# EAGLE design pwmdmx_rev_B (EAGLE 5.10)
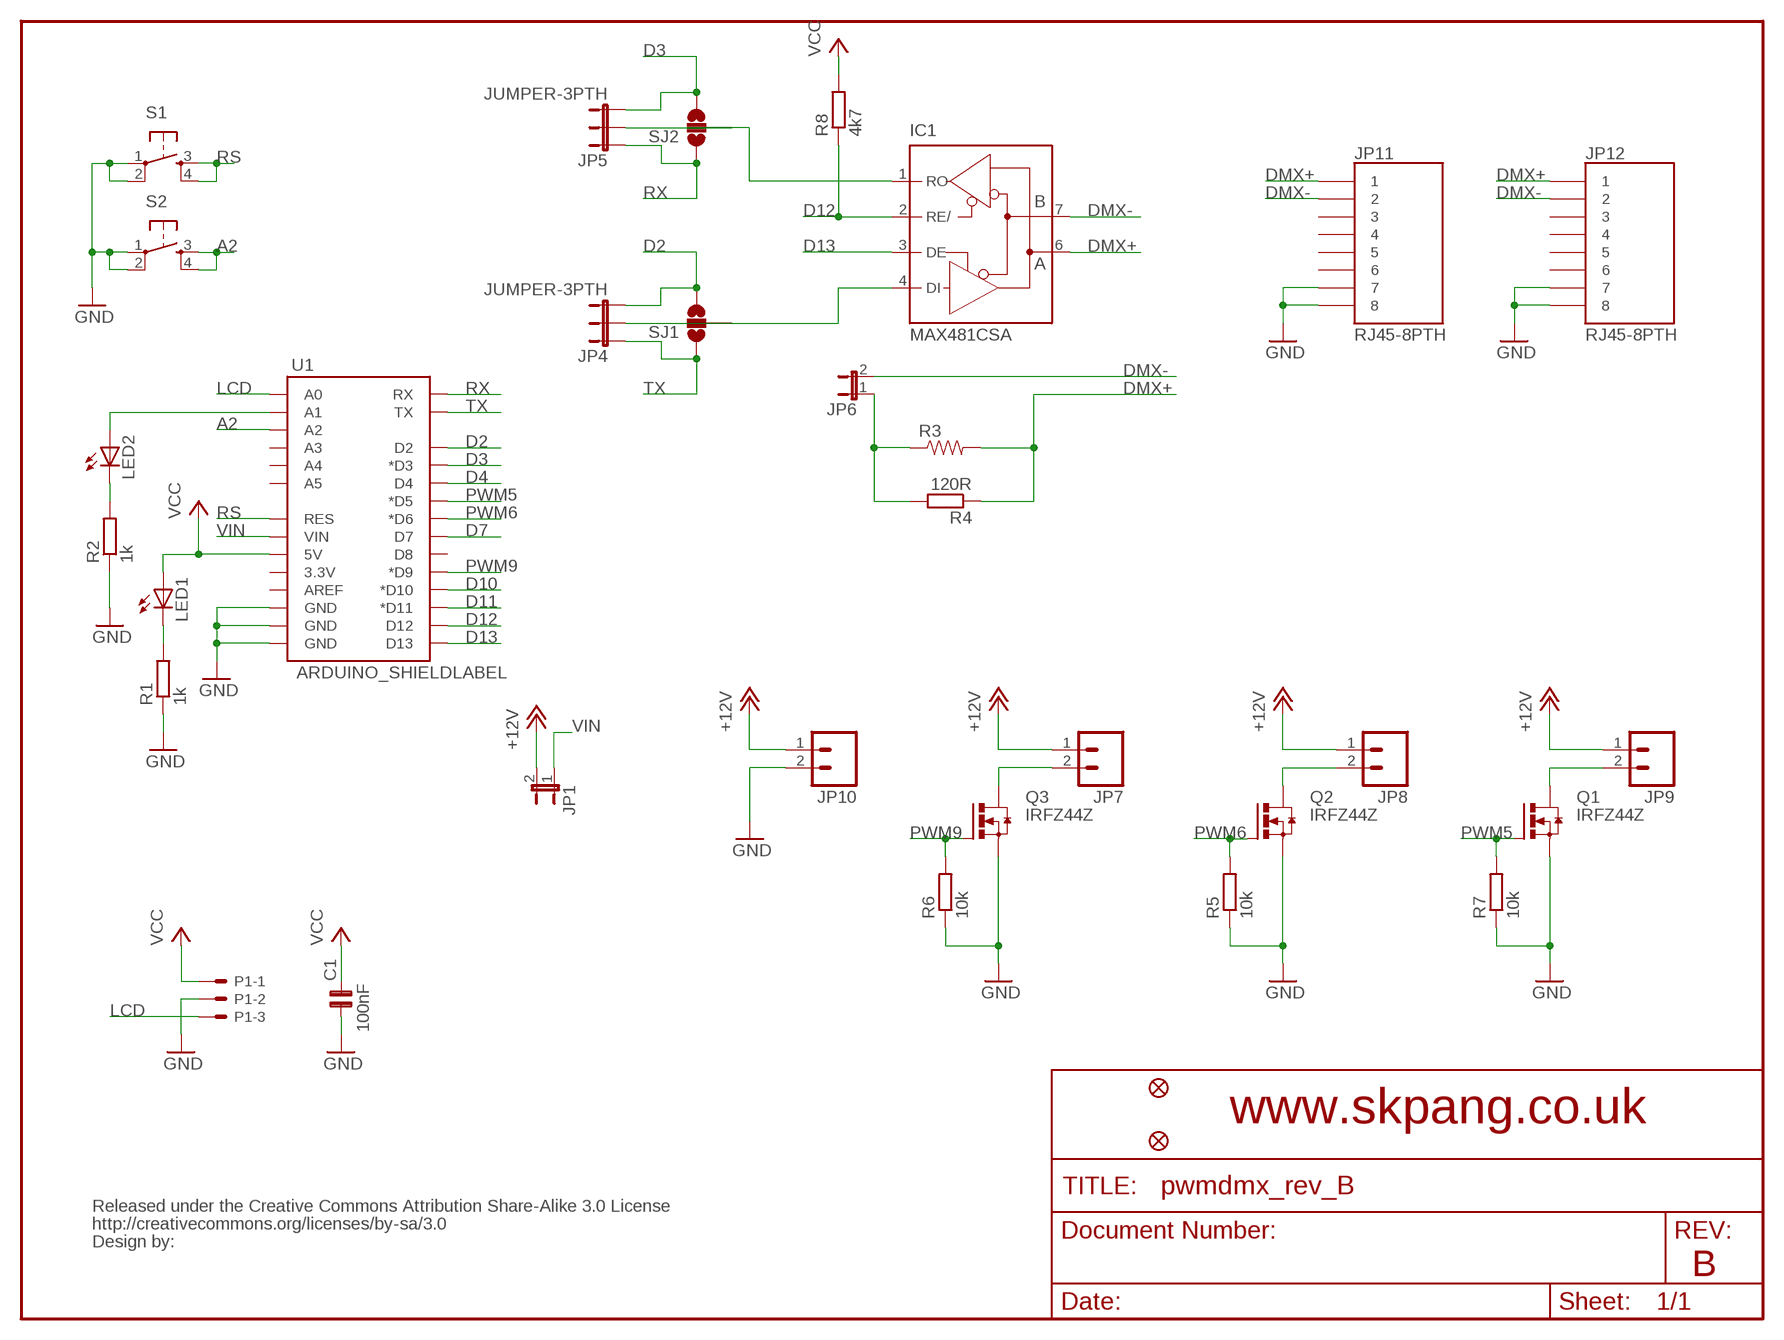
[diagram p0: schematic, sheet 1]

## Parts
C1  100nF  C-NP-SMD-0603  [C-0603]
IC1  MAX481CSA  [SO08]
JP1  JUMPER-2SMD-NO  [SJ_2S-NO]
JP2  FIDUCIAL1X2  [FIDUCIAL-1X2]
JP3  FIDUCIAL1X2  [FIDUCIAL-1X2]
JP4  JUMPER-3PTH  [1X03]
JP5  JUMPER-3PTH  [1X03]
JP6  JUMPER-2PTH  [1X02]
JP7  M025MM  [SCREWTERMINAL-5MM-2]
JP8  M025MM  [SCREWTERMINAL-5MM-2]
JP9  M025MM  [SCREWTERMINAL-5MM-2]
JP10  M025MM  [SCREWTERMINAL-5MM-2]
JP11  RJ45-8PTH  [RJ45-8]
JP12  RJ45-8PTH  [RJ45-8]
LED1  LEDCHIPLED_0805  [CHIPLED_0805]
LED2  LEDCHIPLED_0805  [CHIPLED_0805]
P1  22-23-2031  [22-23-2031]
Q1  IRFZ44Z  IRF3704S  [D2PACK]
Q2  IRFZ44Z  IRF3704S  [D2PACK]
Q3  IRFZ44Z  IRF3704S  [D2PACK]
R1  1k  R-EU_M0805  [M0805]
R2  1k  R-EU_M0805  [M0805]
R3  RESISTORPTH-1/4W  [AXIAL-0.4]
R4  120R  R-EU_M1206  [M1206]
R5  10k  R-EU_M0805  [M0805]
R6  10k  R-EU_M0805  [M0805]
R7  10k  R-EU_M0805  [M0805]
R8  4k7  R-EU_M0805  [M0805]
S1  TAC_SWITCHPTH  [TACTILE-PTH]
S2  TAC_SWITCHPTH  [TACTILE-PTH]
SJ1  SOLDERJUMPER_2WAYS  [SJ_3]
SJ2  SOLDERJUMPER_2WAYS  [SJ_3]
U1  ARDUINO_SHIELDLABEL  [DUEMILANOVE_SHIELD]
U$1  CREATIVE_COMMONS  [CREATIVE_COMMONS]

## Nets
+12V: JP1.2 JP7.1 JP8.1 JP9.1 JP10.1
A1: LED2.A U1.A1
A2: S2.3 S2.4 U1.A2
D2: JP4.3 SJ1.3 U1.D2
D3: JP5.3 SJ2.3 U1.D3(*D3)
D4: U1.D4
D7: U1.D7
D10: U1.D10(*D10)
D11: U1.D11(*D11)
D12: IC1.2(RE/) R8.1 U1.D12
D13: IC1.3(DE) U1.D13
DMX+: IC1.6(A) JP11.1 JP12.1 R3.P$2 R4.1
DMX-: IC1.7(B) JP6.2 JP11.2 JP12.2
GND: C1.1 JP10.2 JP11.7 JP11.8 JP12.7 JP12.8 P1.2 Q1.3(S) Q2.3(S) Q3.3(S) R1.1 R2.1 R5.1 R6.1 R7.1 S1.1 S1.2 S2.1 S2.2 U1.GND@0(GND) U1.GND@1(GND) U1.GND@2(GND)
LCD: P1.3 U1.A0
N$2: IC1.4(DI) JP4.2 SJ1.2
N$3: IC1.1(RO) JP5.2 SJ2.2
N$4: LED1.C R1.2
N$5: LED2.C R2.2
N$6: JP9.2 Q1.2(D)
N$9: JP8.2 Q2.2(D)
N$13: JP6.1 R3.P$1 R4.2
N$14: JP7.2 Q3.2(D)
PWM5: Q1.1(G) R7.2 U1.D5(*D5)
PWM6: Q2.1(G) R5.2 U1.D6(*D6)
PWM9: Q3.1(G) R6.2 U1.D9(*D9)
RS: S1.3 S1.4 U1.RES
RX: JP5.1 SJ2.1 U1.RX
TX: JP4.1 SJ1.1 U1.TX
VCC: C1.2 LED1.A P1.1 R8.2 U1.5V
VIN: JP1.1 U1.VIN
Unconnected: JP11.3 JP11.4 JP11.5 JP11.6 JP12.3 JP12.4 JP12.5 JP12.6 U1.3.3V U1.A3 U1.A4 U1.A5 U1.AREF U1.D8

## Notes on the sheet
- www.skpang.co.uk
- B

## Power pins joined to a net without a drawn wire
GND: IC1.5(GND)
VCC: IC1.8(VCC)

## Library data of the parts
C1 = skpang_lib:C-NP: NON-POLARIZED FILM/CHIP
IC1 = maxim:MAX481CSA: RS485 TRANSEIVER
JP1 JP6 = SparkFun:JUMPER-2: Jumper Basic 0.1" spaced jumper. Use with breakaway headers.
JP2 JP3 = SparkFun:FIDUCIAL: Fiducial Alignment Points Various fiducial points for machine vision alignment.
JP4 JP5 = SparkFun:JUMPER-3
JP7-JP10 = SparkFun:M02: Header 2 Standard 2-pin 0.1" header. Use with straight break away headers (SKU : PRT-00116), right angle break away headers (PRT-00553), swiss pins (PRT-00743), machine pins (PRT-00117), and female headers (PRT-00115). Molex polarized connector foot print use with SKU : PRT-08233 with associated crimp pins and housings.
JP11 JP12 = SparkFun:RJ45-8: RJ45 Jack Simple RJ45, 8-pin connection - connector for common Cat5, Cat5e, and Cat6 Ethernet cables. Footprint not yet proven in production. Connector sku is PRT-00643; Breakout PCB sku is BOB-00716.
LED1 LED2 = led:LED: LED OSRAM: - CHIPLED LG R971, LG N971, LY N971, LG Q971, LY Q971, LO R971, LY R971 LH N974, LH R974 LS Q976, LO Q976, LY Q976 LO Q996 - Hyper CHIPLED LW Q18S LB Q993, LB Q99A, LB R99A - SideLED LS A670, LO A670, LY A670, LG A670, LP A670 LB A673, LV A673, LT A673, LW A673 LH A674 LY A675 LS A676, LA A676, LO A676, LY A676, LW A676 LS A679, LY A679, LG A679 - Hyper Micro SIDELED® LS Y876, LA Y876, LO Y876, LY Y876 LT Y87S - SmartLED LW L88C, LW L88S LB L89C, LB L89S, LG L890 LS L89K, LO L89K, LY L89K LS L896, LA L896, LO L896, LY L896 - TOPLED LS T670, LO T670, LY T670, LG T670, LP T670 LSG T670, LSP T670, LSY T670, LOP T670, LYG T670 LG T671, LOG T671, LSG T671 LB T673, LV T673, LT T673, LW T673 LH T674 LS T676, LA T676, LO T676, LY T676, LB T676, LH T676, LSB T676, LW T676 LB T67C, LV T67C, LT T67C, LS T67K, LO T67K, LY T67K, LW E67C LS E67B, LA E67B, LO E67B, LY E67B, LB E67C, LV E67C, LT E67C LW T67C LS T679, LY T679, LG T679 LS T770, LO T770, LY T770, LG T770, LP T770 LB T773, LV T773, LT T773, LW T773 LH T774 LS E675, LA E675, LY E675, LS T675 LS T776, LA T776, LO T776, LY T776, LB T776 LHGB T686 LT T68C, LB T68C - Hyper Mini TOPLED® LB M676 - Mini TOPLED Santana® LG M470 LS M47K, LO M47K, LY M47K Source: http://www.osram.convergy.de LUXEON: - LUMILED® LXK2-PW12-R00, LXK2-PW12-S00, LXK2-PW14-U00, LXK2-PW14-V00 LXK2-PM12-R00, LXK2-PM12-S00, LXK2-PM14-U00 LXK2-PE12-Q00, LXK2-PE12-R00, LXK2-PE12-S00, LXK2-PE14-T00, LXK2-PE14-U00 LXK2-PB12-K00, LXK2-PB12-L00, LXK2-PB12-M00, LXK2-PB14-N00, LXK2-PB14-P00, LXK2-PB14-Q00 LXK2-PR12-L00, LXK2-PR12-M00, LXK2-PR14-Q00, LXK2-PR14-R00 LXK2-PD12-Q00, LXK2-PD12-R00, LXK2-PD12-S00 LXK2-PH12-R00, LXK2-PH12-S00 LXK2-PL12-P00, LXK2-PL12-Q00, LXK2-PL12-R00 Source: www.luxeon.com KINGBRIGHT: KA-3528ASYC Source: www.kingbright.com
P1 = con-molex:22-23-2031: .100" (2.54mm) Center Header - 3 Pin
Q1-Q3 = transistor-power:IRF3704: SMPS MOSFET HEXFET® Power MOSFET Source: http://www.irf.com/product-info/datasheets/data/irf3704.pdf
R1 R2 R4-R8 = resistor:R-EU_: RESISTOR, European symbol
R3 = SparkFun:RESISTOR: Resistor Basic schematic elements and footprints for 0603, 1206, and PTH resistors.
S1 S2 = SparkFun:TAC_SWITCH: Momentary Switch Button commonly used for reset or general input. Spark Fun Electronics SKU : COM-00097
SJ1 SJ2 = SparkFun:SOLDERJUMPER_2WAY: Solder Jumper 2 way solder jumper
U1 = skpang_lib:ARDUINO_SHIELD
U$1 = SparkFun:CREATIVE_COMMONS

## Board
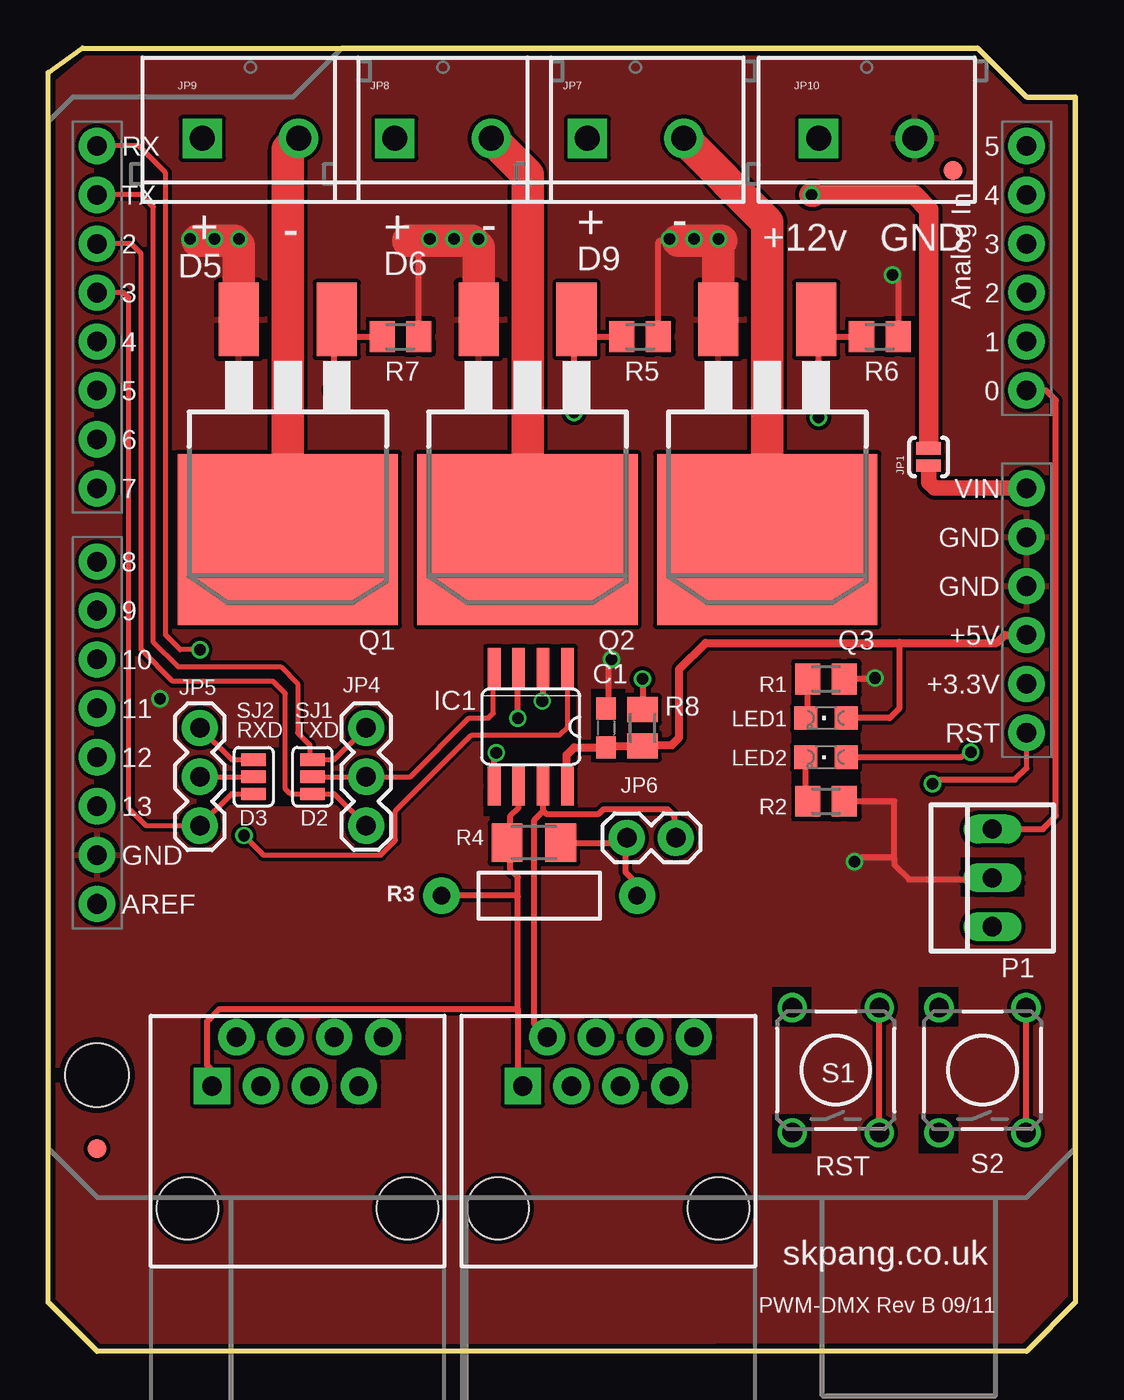
[diagram p1: board, top side]
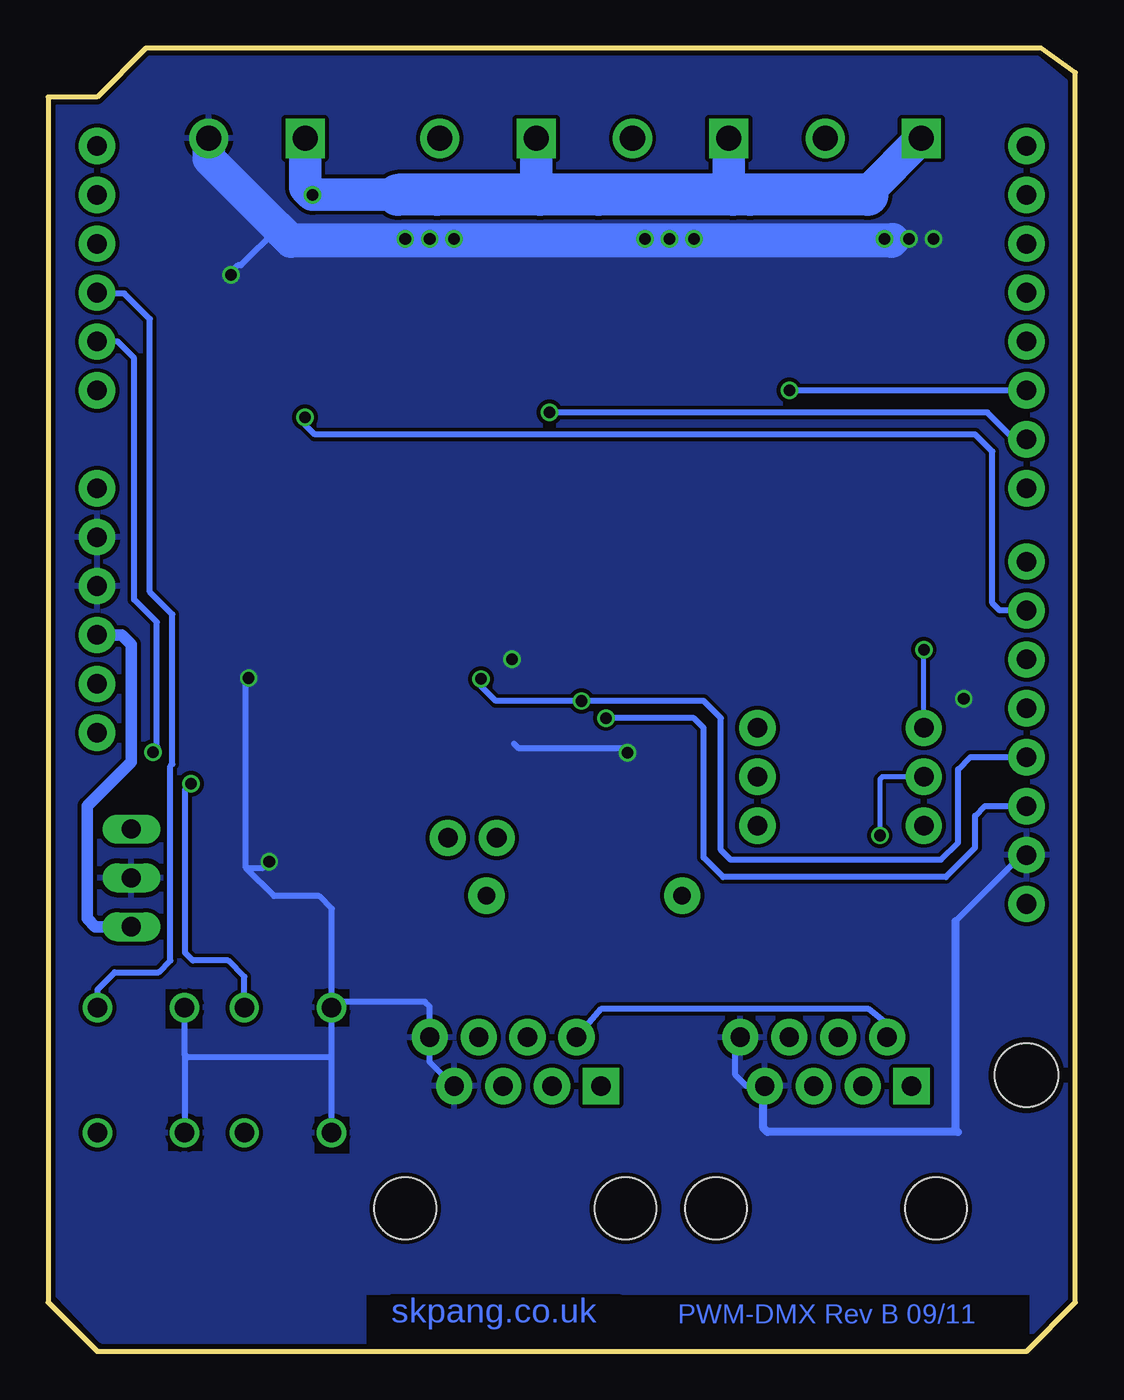
[diagram p2: board, bottom side, seen from below]

Size 53.34 x 67.69 mm. Coordinates in mm from the lower left corner, seen from the top.
Outline: 0,2.54 0,66.42 1.78,67.69 48.26,67.69 50.8,65.15 53.34,65.15 53.34,2.54 50.8,0 2.54,0 0,2.54
Copper layers (1*16): Top 0.035mm / dielectric 1.5mm / Bottom 0.035mm
Design rules "Fusion_eagle_rule_v1.1 *": minimum track width 6mil, minimum drill 12mil, track to track 8mil, track to pad 8mil, pad to pad 8mil, via to via 8mil, smd to smd 0mil, copper to edge 10mil, drill to drill 10mil, minimum pad ring 10mil, minimum via ring 6mil, stop-mask expansion 2mil, vias tented up to drill 100mil, thermal gap 10mil
tRestrict: area 38.6,27.6 to 42.2,35.9; area 28.2,30.6 to 30,34.4; area 22.6,27.8 to 27.4,36.7; area 16.5,51.7 to 20.1,53.7; area 29,51.7 to 32.5,53.7; area 41.4,51.7 to 45.2,53.7; area 9.7,28.3 to 14.7,31.4; area 37.6,16.9 to 39.6,18.9; area 37.6,10.3 to 39.6,12.3; area 45.2,10.3 to 47.2,12.3; area 45.2,16.9 to 47.2,18.9; area 15,12.6 to 17.3,14.9; area 16.3,15.2 to 18.5,17.5; area 31.1,12.6 to 33.4,14.9; area 32.4,15.2 to 34.7,17.5; area 47.4,23.6 to 50.7,25.7
bRestrict: area 37.7,16.9 to 39.5,18.8; area 45.3,16.8 to 47.2,18.8; area 37.7,10.3 to 39.5,12.2; area 45.3,10.4 to 47.1,12.2; area 2.4,0.3 to 36.8,2.9

### Footprints (pad centres in the part's own frame; a part is rotated, then mirrored left to right if it is on the bottom)
C-0603 = smd 1.143 x 1.016: 1 -1.016,0; 2 1.016,0
SO08 = smd 0.66 x 2.032: 1 -1.905,-3.073; 2 -0.635,-3.073; 3 0.635,-3.073; 4 1.905,-3.073; 5 1.905,3.073; 6 0.635,3.073; 7 -0.635,3.073; 8 -1.905,3.073
SJ_2S-NO = smd 0.635 x 1.27: 1 -0.45,0; 2 0.45,0
FIDUCIAL-1X2 = smd 1 x 1: 1 0,0
1X03 = drill 1.016 pad 1.88 round: 1 0,0; 2 2.54,0; 3 5.08,0
1X02 = drill 1.016 pad 1.88 round: 1 0,0; 2 2.54,0
SCREWTERMINAL-5MM-2 = drill 1.3 pad 2.032 square: 1 0,0 | drill 1.3 pad 2.032 round: 2 5,0
RJ45-8 = drill 1 pad 1.88 square: 1 -4.445,6.35 | drill 1 pad 1.88 round: 2 -3.175,8.89; 3 -1.905,6.35; 4 -0.635,8.89; 5 0.635,6.35; 6 1.905,8.89; 7 3.175,6.35; 8 4.445,8.89 | hole 3.2: -5.715,0; 5.715,0
CHIPLED_0805 = smd 1.2 x 1.2: A 0,-1.05; C 0,1.05
22-23-2031 = drill 1 long: 1 -2.54,0; 2 0,0; 3 2.54,0
D2PACK = smd 2.083 x 3.81: 1 -2.54,-8.89; 3 2.54,-8.89 | smd 11.43 x 8.89: 2 0,2.54
M0805 = smd 1.3 x 1.6: 1 -0.95,0; 2 0.95,0
AXIAL-0.4 = drill 0.9 pad 1.88 round: P$1 -5.08,0; P$2 5.08,0
M1206 = smd 1.6 x 2: 1 -1.4,0; 2 1.4,0
TACTILE-PTH = drill 1.016 round: 1 -3.251,2.261; 2 3.251,2.261; 3 -3.251,-2.261; 4 3.251,-2.261
SJ_3 = smd 0.635 x 1.27: 1 -0.889,0; 2 0,0; 3 0.889,0
DUEMILANOVE_SHIELD = drill 1.016 pad 1.88 round: 3.3V 50.8,26.67; 5V 50.8,29.21; A0 50.8,41.91; A1 50.8,44.45; A2 50.8,46.99; A3 50.8,49.53; A4 50.8,52.07; A5 50.8,54.61; AREF 2.54,15.24; D2 2.54,49.53; D3 2.54,46.99; D4 2.54,44.45; D5 2.54,41.91; D6 2.54,39.37; D7 2.54,36.83; D8 2.54,33.02; D9 2.54,30.48; D10 2.54,27.94; D11 2.54,25.4; D12 2.54,22.86; D13 2.54,20.32; GND@0 50.8,31.75; GND@1 50.8,34.29; GND@2 2.54,17.78; RES 50.8,24.13; RX 2.54,54.61; TX 2.54,52.07; VIN 50.8,36.83 | hole 3.302: 2.54,6.35

### Placement (x,y rotation side)
C1  28.96,32.38 270 top
IC1  25.06,32.44 180 top
JP1  45.72,46.46 90 top
JP2  2.54,10.54 0 top
JP3  46.99,61.34 0 top
JP4  16.51,32.38 270 top
JP5  7.87,32.38 270 top
JP6  30.05,26.67 0 top
JP7  28,63 0 top
JP8  18,63 0 top
JP9  8,63 0 top
JP10  40,63 0 top
JP11  29.08,7.43 0 top
JP12  12.95,7.43 0 top
LED1  40.39,32.89 90 top
LED2  40.39,30.86 90 top
P1  49.02,24.59 90 top
Q1  12.45,44.7 180 top
Q2  24.89,44.7 180 top
Q3  37.34,44.7 180 top
R1  40.39,34.92 180 top
R2  40.39,28.57 180 top
R3  25.5,23.67 180 top
R4  25.22,26.41 0 top
R5  30.73,52.7 180 top
R6  43.18,52.7 180 top
R7  18.29,52.7 180 top
R8  30.86,32.38 270 top
S1  40.89,14.6 90 top
S2  48.51,14.6 90 top
SJ1  13.72,29.84 270 top
SJ2  10.67,29.84 270 top
U1  0,8 0 top
U$1  20.32,-3.43 0 top  (outside the outline)

### Tracks (layer width: path | path; a pad name or v marks a point on that pad's centre or on a via)
+12V  (via drill 0.6)
  Top 0.61: 45.72,47.12 JP1.2
  Top 1.016: 39.75,60.07 44.96,60.07 45.72,59.31 45.72,47.12
  Top 1.27: v39.62,60.07 39.75,60.07
  Bottom 1.676: 16.89,60.07 17.02,60.2 | 24.77,60.07 24.64,60.2 | 35.18,60.07 v39.62,60.07 40,60.45 JP10.1 | 10.79,60.07 10.79,60.2 JP9.1 | JP8.1 18,60.29 17.78,60.07 | JP7.1 28,60.26 27.81,60.07
  Bottom 1.93: 33.15,60.07 33.78,60.2
  Bottom 2.184: 10.79,60.07 16.89,60.07 17.78,60.07 24.77,60.07 27.81,60.07 33.15,60.07 35.18,60.07
A1  (via drill 0.6)
  Top 0.305: LED2.A 47.4,30.86 v47.9,31.11
  Bottom 0.305: v47.9,31.11 47.65,31.37 47.7,31.42 47.7,37.87 48.87,39.04 48.87,51.59 49.73,52.45 U1.A1
A2
  Top 0.305: S2.3 S2.4
  Bottom 0.305: S2.4 50.77,18.8 49.89,19.68 47.6,19.68 46.99,20.29 46.99,30.4 46.89,30.5 46.89,38.28 48.06,39.45 48.06,53.62 49.38,54.94 50.75,54.94 U1.A2
D2
  Top 0.254: JP4.3 14.86,28.95 SJ1.3 12.57,28.95 12.32,29.21 12.32,34.16 11.68,34.8 6.48,34.8 4.83,36.45 4.83,57.02 4.32,57.53 U1.D2
D3
  Top 0.254: SJ2.3 9.53,28.95 JP5.3 5.08,27.3 4.19,28.19 4.19,54.74 3.94,54.99 U1.D3
D12  (via drill 0.6)
  Top 0.305: v30.86,34.92 R8.1 | IC1.2 25.7,33.83 v25.65,33.78
  Bottom 0.305: v25.65,33.78 19.3,33.78 18.41,32.89 18.41,26.03 17.91,25.53 6.99,25.53 6.1,26.41 6.1,30.23 5.46,30.86 U1.D12 | v25.65,33.78 25.78,33.78 | 25.78,33.78 30.1,33.78 30.86,34.54 v30.86,34.92 | v25.65,33.78 25.53,33.91 | v25.65,33.78 25.78,33.65 25.91,33.65 25.78,33.78
D13  (via drill 0.6)
  Top 0.305: v24.38,32.89 24.38,35.47 IC1.3
  Bottom 0.305: U1.D13 4.7,28.32 5.21,27.81 5.21,26.16 6.73,24.64 18.29,24.64 19.3,25.65 19.3,32.38 19.81,32.89 v24.38,32.89
DMX+
  Top 0.305: IC1.6 24.43,28.24 24,27.81 24,26.6 R4.1 | R4.1 23.75,26.41 | JP11.1 24.38,14.03 24.38,17.78 | JP12.1 8.51,14.6 8.26,14.86 8.26,17.14 8.89,17.78 24.38,17.78 | 24.38,17.78 24.38,23.62 | 24.38,23.62 24.38,24.64 24,25.02 24,26.23 R4.1 | R3.P$2 24.33,23.67 24.38,23.62
DMX-
  Top 0.305: 25.7,28.06 IC1.7 | 25.7,28.06 25.25,27.61 25.25,16.98 JP11.2 | 25.7,28.06 25.71,28.06 25.86,27.91 28.6,27.91 28.85,28.17 32.16,28.17 32.51,27.81 32.51,26.75 JP6.2
  Bottom 0.305: JP12.2 9.78,17.02 10.74,17.78 24.65,17.78 JP11.2
GND  (via drill 0.6)
  Top 0.254: 34.8,57.53 v34.8,57.78 | 34.8,57.53 35.05,57.28 | 34.8,57.53 34.54,57.78 35.05,57.78 | S1.2 38.56,17.78
  Top 0.305: R2.1 43.94,28.57 43.94,25.53 | 43.94,25.53 43.94,25.27 44.7,24.51 48.94,24.51 P1.2 | R1.1 42.88,34.92 v42.93,34.98 | v29.26,35.94 29.26,35.84 29.11,35.69 29.11,33.58 C1.1 | IC1.5 23.16,31.16 23.22,31.16 v23.27,31.09 | v41.86,25.42 41.86,25.58 41.96,25.68 43.79,25.68 43.94,25.53 | R5.1 31.68,57.62 31.75,57.68 32.41,57.68 | R6.1 44.13,55.62 v43.84,55.9 | R7.1 19.24,57.41 19.51,57.68 | 34.95,57.68 34.95,57.63 35.05,57.53
  Top 0.406: v7.37,57.78 v8.64,57.78 8.74,57.68 9.65,57.68
  Top 1.676: Q3.3 34.8,57.53 34.95,57.68 32.72,57.68 | Q2.3 22.35,57.33 22,57.68 19.51,57.68 18.69,57.68 | Q1.3 9.91,57.43 9.65,57.68 7.77,57.68
  Bottom 0.305: v42.93,34.98 42.93,34.92 43.08,34.77 43.08,25.12 | 29.16,31.57 28.91,31.32 23.42,31.32 23.32,31.22 v23.27,31.09 23.16,31.32 | v29.26,35.94 29.16,35.84 | S1.2 S1.1 | 46.25,15.42 S2.1 | 46.25,15.42 S2.2 | S1.2 38.63,15.29 38.66,15.26 46.1,15.26 46.25,15.42 | 43.08,25.12 41.6,23.65 39.27,23.65 38.61,22.99 38.61,17.88 S1.2 | 43.08,25.12 42.16,25.12 v41.86,25.42 | v43.84,55.9 43.84,56.06 43.48,56.41 43.33,56.41 41.4,58.34 | JP12.7 17.08,13.78 17.65,14.35 17.65,16.06 JP12.8 17.27,16.45 | JP11.7 33.53,15.05 JP11.8 33.53,17.91 33.78,18.16 38.33,18.16 S1.2 | U1.GND@2 2.79,25.78 6.22,22.35
  Bottom 0.406: 6.22,22.35 6.22,11.52 6.1,11.4 16,11.4 16.2,11.6 16.2,13.71 JP12.7
  Bottom 1.676: JP10.2 45,61.94 41.4,58.34
  Bottom 1.778: 9.5,57.73 9.55,57.68 40.74,57.68 41.4,58.34
  other vias: 9.91,57.78 19.81,57.78 21.08,57.78 22.35,57.78 32.26,57.78 33.53,57.78 5.8,33.9
  pour Bottom: 2.03,67.18 48.01,67.18 50.55,64.64 52.83,64.64 52.83,2.95 50.55,0.56 2.69,0.46 0.51,2.75 0.51,65.91
  pour Top: 2.03,67.18 48.01,67.18 50.55,64.64 52.83,64.64 52.83,2.95 50.55,0.56 2.69,0.46 0.51,2.75 0.51,65.91
LCD
  Top 0.254: 51.82,49.91 U1.A0
  Top 0.305: P1.3 51.65,27.13 52.32,27.81 52.32,49.4 51.82,49.91
N$2
  Top 0.254: SJ1.2 JP4.2 18.8,29.84 21.84,32.89 22.86,32.89 23.11,33.15 23.11,35.47 IC1.4
  Top 0.406: IC1.4
N$3  (via drill 0.6)
  Top 0.254: IC1.1 26.97,32.43 26.54,32 21.97,32 18.03,28.07 18.03,26.54 17.27,25.78 11.18,25.78 v10.16,26.8 | JP5.2 SJ2.2
  Bottom 0.254: v10.16,26.8 10.16,29.72 10.03,29.84 JP5.2
N$4
  Top 0.305: R1.2 39.44,32.99 LED1.C
N$5
  Top 0.305: LED2.C 39.34,28.67 R2.2
N$6
  Top 1.676: Q1.2 12.45,62.45 JP9.2
N$9
  Top 1.676: Q2.2 24.89,61.11 JP8.2
N$13
  Top 0.305: R4.2 29.79,26.41 JP6.1 29.97,26.59 29.97,24.89 30.58,24.28 R3.P$1
N$14
  Top 1.676: Q3.2 37.34,58.66 JP7.2
PWM5  (via drill 0.6)
  Top 0.305: v14.86,49.91 14.86,52.7 | 14.86,52.7 14.86,53.47 Q1.1 | 14.86,52.7 R7.2
  Bottom 0.305: U1.D5 v14.86,49.91
PWM6  (via drill 0.6)
  Top 0.305: v27.3,48.77 27.3,52.7 | 27.3,52.7 27.3,53.47 Q2.1 | 27.3,52.7 R5.2
  Bottom 0.305: v27.3,48.77 4.57,48.77 3.17,47.37 U1.D6
PWM9  (via drill 0.6)
  Top 0.305: v40.01,48.51 40.01,52.83 | 40.01,52.83 40.01,53.47 Q3.1 | R6.2 40.13,52.7 40.01,52.83
  Bottom 0.305: v40.01,48.51 40.01,48.13 39.5,47.62 5.21,47.62 4.32,46.73 4.32,38.86 3.94,38.48 U1.D9
RS  (via drill 0.6)
  Top 0.254: 50.8,30.3 U1.RES
  Top 0.305: S1.3 S1.4 | v45.92,29.49 46.13,29.69 50.19,29.69 50.8,30.3
  Bottom 0.305: S1.4 43.16,19.45 43.99,20.29 45.82,20.29 46.23,20.7 46.23,29.18 v45.92,29.49
RX  (via drill 0.6)
  Top 0.254: SJ2.1 9.53,30.73 JP5.1 | v7.87,36.45 6.86,36.45 6.1,37.21 6.1,61.21 4.7,62.61 U1.RX
  Bottom 0.254: JP5.1 v7.87,36.45
TX
  Top 0.254: JP4.1 14.86,30.73 SJ1.1 13.59,30.86 13.59,31.5 12.95,32.13 12.95,34.67 12.06,35.56 6.73,35.56 5.46,36.83 5.46,59.44 4.83,60.07 U1.TX
VCC
  Top 0.305: LED1.A 43.69,32.89 44.2,33.4 44.2,36.8
  Top 0.406: C1.2 29.13,31.57 | C1.2 29.07,31.52 | C1.2 29.02,31.43 R8.2 30.92,31.5 32.38,31.5 32.77,31.88 32.77,35.43 34.14,36.8 44.2,36.8 49.25,36.8 49.66,37.21 U1.5V | C1.2 27.3,31.37 26.92,30.99 26.92,29.41 IC1.8
  Bottom 0.61: P1.1 50.88,22.05 51.31,22.48 51.31,28.32 49.02,30.61 49.02,36.7 49.53,37.21 U1.5V
VIN
  Top 0.61: JP1.1 45.72,45.59
  Top 0.813: 45.72,45.59 45.72,45.13 46.02,44.83 U1.VIN

### Text on the board
Bottom: PWM-DMX Rev B 09/11 | skpang.co.uk
tNames: + | + | - | + | - | - | +12v | GND | D5 | D6 | D9 | RXD | TXD | D3 | D2 | RST | skpang.co.uk | PWM-DMX Rev B 09/11
_tsilk: A1 | RESET